# EAGLE design RGB Lamp Project (EAGLE 6.5.0)
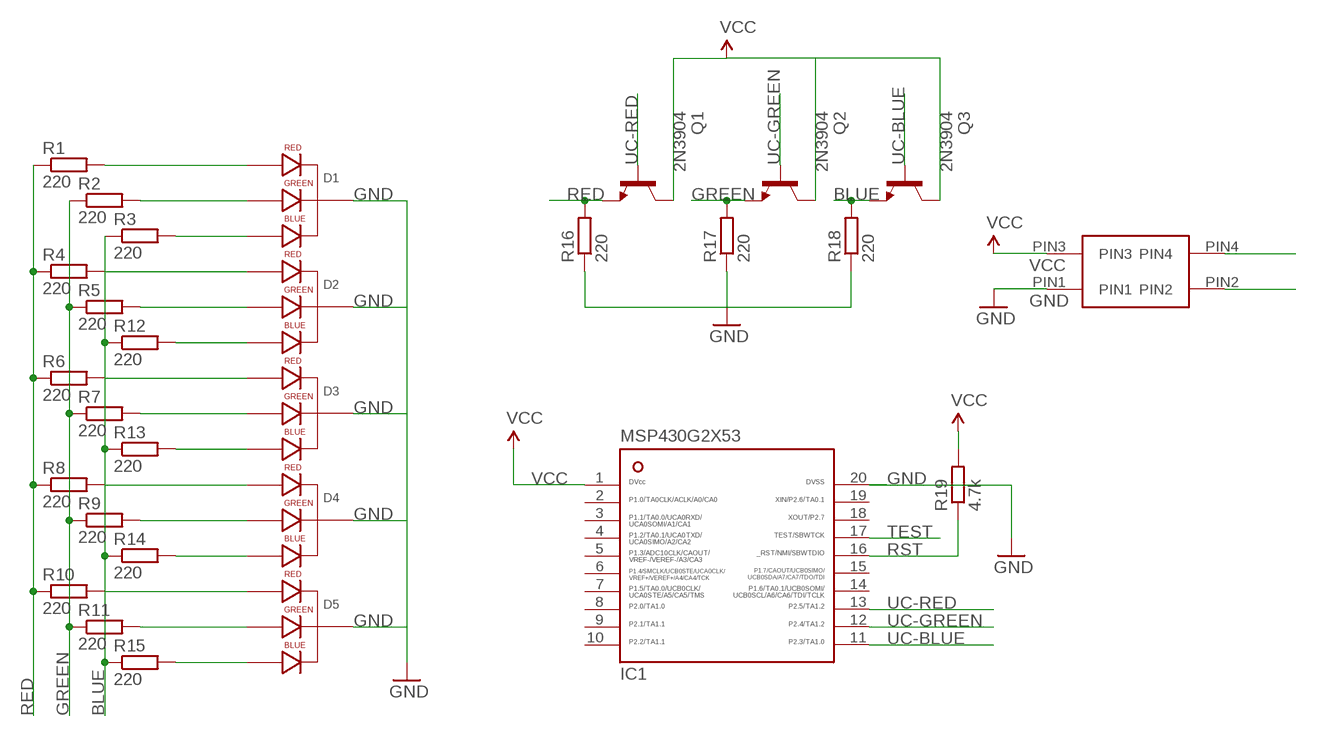
[diagram p0: schematic, sheet 1]

## Parts
D1  LED-RGB-CC-THRUCLEAR  [LED-RGB-THRU]
D2  LED-RGB-CC-THRUCLEAR  [LED-RGB-THRU]
D3  LED-RGB-CC-THRUCLEAR  [LED-RGB-THRU]
D4  LED-RGB-CC-THRUCLEAR  [LED-RGB-THRU]
D5  LED-RGB-CC-THRUCLEAR  [LED-RGB-THRU]
IC1  MSP430G2X53-20PW20  [PW20]
Q1  2N3904  [TO92]
Q2  2N3904  [TO92]
Q3  2N3904  [TO92]
R1  220  R-EU_R0805  [R0805]
R2  220  R-EU_R0805  [R0805]
R3  220  R-EU_R0805  [R0805]
R4  220  R-EU_R0805  [R0805]
R5  220  R-EU_R0805  [R0805]
R6  220  R-EU_R0805  [R0805]
R7  220  R-EU_R0805  [R0805]
R8  220  R-EU_R0805  [R0805]
R9  220  R-EU_R0805  [R0805]
R10  220  R-EU_R0805  [R0805]
R11  220  R-EU_R0805  [R0805]
R12  220  R-EU_R0805  [R0805]
R13  220  R-EU_R0805  [R0805]
R14  220  R-EU_R0805  [R0805]
R15  220  R-EU_R0805  [R0805]
R16  220  R-EU_R0805  [R0805]
R17  220  R-EU_R0805  [R0805]
R18  220  R-EU_R0805  [R0805]
R19  4.7k  R-EU_R0805  [R0805]
U$1  PINHEADER-2X2-SMD  [PINHEADER-2X2-SMD]

## Nets
BLUE: Q3.3(E) R3.1 R12.1 R13.1 R14.1 R15.1 R18.2
GND: D1.2(CATHODE) D2.2(CATHODE) D3.2(CATHODE) D4.2(CATHODE) D5.2(CATHODE) IC1.20 R16.1 R17.1 R18.1 U$1.PIN1
GREEN: Q2.3(E) R2.1 R5.1 R7.1 R9.1 R11.1 R17.2
N$1: D1.1(RED_CATHODE) R1.2
N$2: D1.3(GREEN_CATHODE) R2.2
N$3: D1.4(BLUE_CATHODE) R3.2
N$4: D2.1(RED_CATHODE) R4.2
N$5: D2.3(GREEN_CATHODE) R5.2
N$6: D2.4(BLUE_CATHODE) R12.2
N$7: D3.1(RED_CATHODE) R6.2
N$8: D3.3(GREEN_CATHODE) R7.2
N$9: D3.4(BLUE_CATHODE) R13.2
N$10: D4.1(RED_CATHODE) R8.2
N$11: D4.3(GREEN_CATHODE) R9.2
N$12: D4.4(BLUE_CATHODE) R14.2
N$13: D5.1(RED_CATHODE) R10.2
N$14: D5.4(BLUE_CATHODE) R15.2
N$15: D5.3(GREEN_CATHODE) R11.2
RED: Q1.3(E) R1.1 R4.1 R6.1 R8.1 R10.1 R16.2
RST: IC1.16 R19.1 U$1.PIN4
TEST: IC1.17 U$1.PIN2
UC-BLUE: IC1.11 Q3.2(B)
UC-GREEN: IC1.12 Q2.2(B)
UC-RED: IC1.13 Q1.2(B)
VCC: IC1.1 Q1.1(C) Q2.1(C) Q3.1(C) R19.2 U$1.PIN3
Unconnected: IC1.2 IC1.3 IC1.4 IC1.5 IC1.6 IC1.7 IC1.8 IC1.9 IC1.10 IC1.14 IC1.15 IC1.18 IC1.19

## Library data of the parts
D1-D5 = SparkFun-LED:LED-RGB-CC-THRU: RGB Through-hole common cathode LED SparkFun Storefront: COM-00105 (Clear) COM-09264 (Diffuse); PROD_ID: DIO-08418
IC1 = ti_msp430:MSP430G2X53-20
Q1-Q3 = transistor-npn:2N3904: NPN Transistor
R1-R19 = rcl:R-EU_: RESISTOR, European symbol
U$1 = Andre:PINHEADER-2X2-SMD

## Board
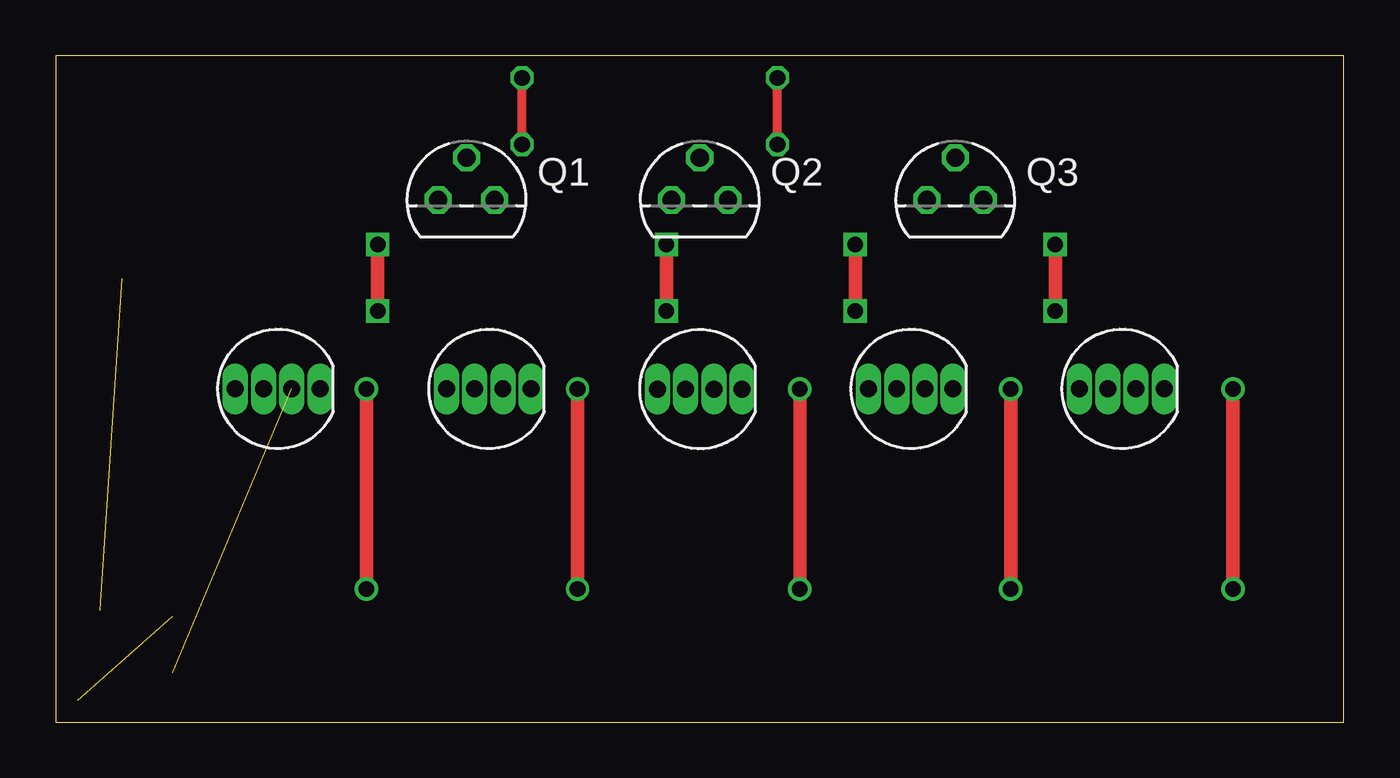
[diagram p1: board, top side]
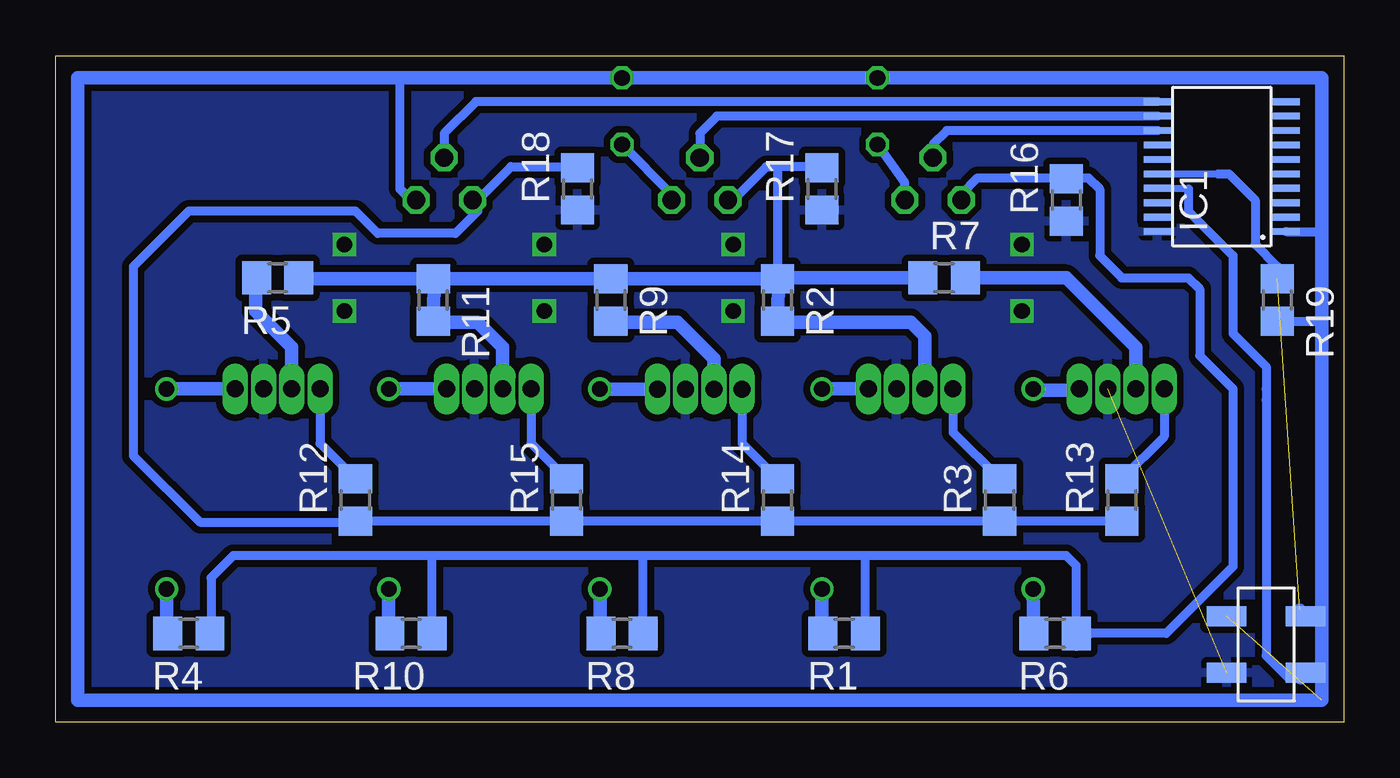
[diagram p2: board, bottom side, seen from below]

Size 58 x 30 mm. Coordinates in mm from the lower left corner, seen from the top.
Outline: 0,0 58,0 58,30 0,30 0,0
Copper layers (1*16): Top 0.035mm / dielectric 1.5mm / Bottom 0.035mm
Design rules "default *": minimum track width 10mil, minimum drill 24mil, track to track 10mil, track to pad 10mil, pad to pad 10mil, via to via 10mil, smd to smd 10mil, copper to edge 40mil, drill to drill 8mil, minimum pad ring 0mil, minimum via ring 0mil, stop-mask expansion 4mil, vias tented up to drill 0mil, thermal gap 10mil

### Footprints (pad centres in the part's own frame; a part is rotated, then mirrored left to right if it is on the bottom)
LED-RGB-THRU = drill 0.762 pad 0.889 long: 1 1.905,0; 2 0.635,0; 3 -0.635,0; 4 -1.905,0
PW20 = smd 0.3 x 1.2: 1 -2.925,-2.9; 2 -2.275,-2.9; 3 -1.625,-2.9; 4 -0.975,-2.9; 5 -0.325,-2.9; 6 0.325,-2.9; 7 0.975,-2.9; 8 1.625,-2.9; 9 2.275,-2.9; 10 2.925,-2.9; 11 2.925,2.9; 12 2.275,2.9; 13 1.625,2.9; 14 0.975,2.9; 15 0.325,2.9; 16 -0.325,2.9; 17 -0.975,2.9; 18 -1.625,2.9; 19 -2.275,2.9; 20 -2.925,2.9
TO92 = drill 0.813 octagon: 1 1.27,0; 2 0,1.905; 3 -1.27,0
R0805 = smd 1.3 x 1.5: 1 -0.95,0; 2 0.95,0
PINHEADER-2X2-SMD = smd 1.778 x 0.914: PIN1 -1.778,-1.27; PIN2 1.778,-1.27; PIN3 -1.778,1.27; PIN4 1.778,1.27

### Placement (x,y rotation side)
D1  19.5,15 0 top
D2  48,15 0 top
D3  10,15 0 top
D4  29,14.99 0 top
D5  38.5,15 0 top
IC1  5.5,25 90 bottom
Q1  18.5,23.5 0 top
Q2  29,23.5 0 top
Q3  40.5,23.5 0 top
R1  22.5,4 180 bottom
R2  25.5,19 270 bottom
R3  15.5,10 90 bottom
R4  52,4 180 bottom
R5  48,20 180 bottom
R6  13,4 180 bottom
R7  18,20 0 bottom
R8  32.5,4 180 bottom
R9  33,19 270 bottom
R10  42,4 180 bottom
R11  41,19 270 bottom
R12  44.5,10 90 bottom
R13  10,10 90 bottom
R14  25.5,10 90 bottom
R15  35,10 90 bottom
R16  12.5,23.5 90 bottom
R17  23.5,24 90 bottom
R18  34.5,24 90 bottom
R19  3,19 270 bottom
U$1  3.5,3.5 0 bottom

### Tracks (layer width: path | path; a pad name or v marks a point on that pad's centre or on a via)
BLUE
  Bottom 0.406: R13.1 R3.1 R14.1 R15.1 44,9.05 | 44,9.05 R12.1 | 44,9.05 44.05,9 51.5,9 54.5,12 54.5,20.5 52,23 44.5,23 43.5,22 40,22 39,23 39,23.5 37.5,25 34.55,25
  Bottom 0.61: Q3.3 39,23.5 | 34.55,25 R18.2
GND  (via drill 0.7)  (1 unrouted)
  Top 0.61: v14.5,21.5 v14.5,18.5 | v27.5,21.5 v27.5,18.5 | v36,21.5 v36,18.5 | v45,21.5 v45,18.5
  pour Bottom (isolate 0.305): 0.5,29.5 57.5,29.5 57.5,0.5 0.5,0.5
GREEN
  Bottom 0.406: 23.95,25 25.5,25 | 25.5,25 R2.1 | 27.5,23.5 26,25 25.5,25
  Bottom 0.61: 23.55,25 R17.2 23.95,25 | R7.1 25.45,20 R2.1 R9.1 R11.1 47,19.95 R5.1 | Q2.3 27.5,23.5
N$1  (via drill 0.7)
  Top 0.61: v23.5,15 v23.5,6
  Bottom 0.61: D1.1 v23.5,15 | v23.5,6 23.5,4.05 R1.2
N$2
  Bottom 0.61: D1.3 18.86,17.36 19.5,18 25.45,18 R2.2 25.45,19.5
N$3
  Bottom 0.406: D1.4 17.59,13.04 R3.2
N$4  (via drill 0.7)
  Top 0.61: v53,15 v53,6
  Bottom 0.61: D2.1 v53,15 | v53,6 53,4.05 R4.2
N$5
  Bottom 0.61: D2.3 47.37,16.86 49,18.5 49,19.95 R5.2
N$6
  Bottom 0.406: D2.4 46.09,12.54 R12.2
N$7  (via drill 0.7)
  Top 0.61: v14,15 v14,6
  Bottom 0.61: D3.1 11.96,14.95 13.95,14.95 v14,15 | v14,6 R6.2
N$8
  Bottom 0.61: D3.3 9.37,16.86 12.5,20 R7.2
N$9
  Bottom 0.406: D3.4 8.1,12.86 R13.2
N$10  (via drill 0.7)
  Top 0.61: v33.5,15 v33.5,6
  Bottom 0.61: D4.1 v33.49,14.99 v33.5,15 | v33.5,6 33.5,4.05 R8.2
N$11
  Bottom 0.61: D4.3 28.36,16.36 30,18 32.95,18 R9.2
N$12
  Bottom 0.406: D4.4 27.09,12.54 R14.2
N$13  (via drill 0.7)
  Top 0.61: v43,15 v43,6
  Bottom 0.61: D5.1 v43,15 | v43,6 43,4.05 R10.2
N$14
  Bottom 0.406: D5.4 36.59,12.54 R15.2
N$15
  Bottom 0.61: 40.95,19.5 R11.2 40.95,18 39,18 37.87,16.86 D5.3
RED
  Bottom 0.406: 17.23,23.77 16.5,24.5 13.05,24.5 11.5,24.5 11,24 11,21 10,20 7,20 6.5,19.5 6.5,16.5 5,15 5,7 8,4 11.55,4 | 12.05,3.5 12.05,7.05 12.5,7.5 21.5,7.5 | 21.5,7.5 31.5,7.5 | 31.5,7.5 41,7.5 | 41,7.5 50,7.5 51,6.5 51,4.05 R4.1 | R10.1 41.05,7.45 41,7.5 | R8.1 31.55,7.45 31.5,7.5 | R1.1 21.55,7.45 21.5,7.5
  Bottom 0.61: R6.1 12.05,3.5 11.55,4 | 51,3.95 R4.1 | Q1.3 17.23,23.77 | 13.05,24.5 R16.2
RST  (1 unrouted)
  Bottom 0.305: IC1.16 5.67,24.68
  Bottom 0.406: 5.67,24.68 5.17,24.68 4,23.5 4,21.5 3,20.5 R19.1
  Bottom 0.61: 2,5.05 U$1.PIN4
TEST
  Bottom 0.305: IC1.17 7.03,24.02 7,24
  Bottom 0.406: 7,24 7,23 5,21 5,17.5 3.5,16 3.5,15 3.5,14.5 3.5,3 2.5,2 1.95,2
  Bottom 0.61: 1.95,2 U$1.PIN2
UC-BLUE
  Bottom 0.406: IC1.11 39.08,27.93 40.5,26.5 Q3.2
UC-GREEN
  Bottom 0.406: IC1.12 28.23,27.27 29,26.5 Q2.2
UC-RED
  Bottom 0.406: IC1.13 17.88,26.62 18.5,26 Q1.2
VCC  (via drill 0.7)  (1 unrouted)
  Top 0.406: v21,26 v21,29 | v32.5,26 v32.5,29
  Bottom 0.406: Q3.1 42,23.5 42.5,24 42.5,29 | IC1.1 1.07,22.07 1,22 | R19.2 1.05,18.05 1,17 | Q1.1 19.77,24.27 v21,26 | Q2.1 30.27,23.77 v32.5,26
  Bottom 0.61: 1,29 v21,29 v32.5,29 42.5,29 57,29 57,1 1,1 1,17 1,22 1,29